# EAGLE design untitled (EAGLE 7.2.0)
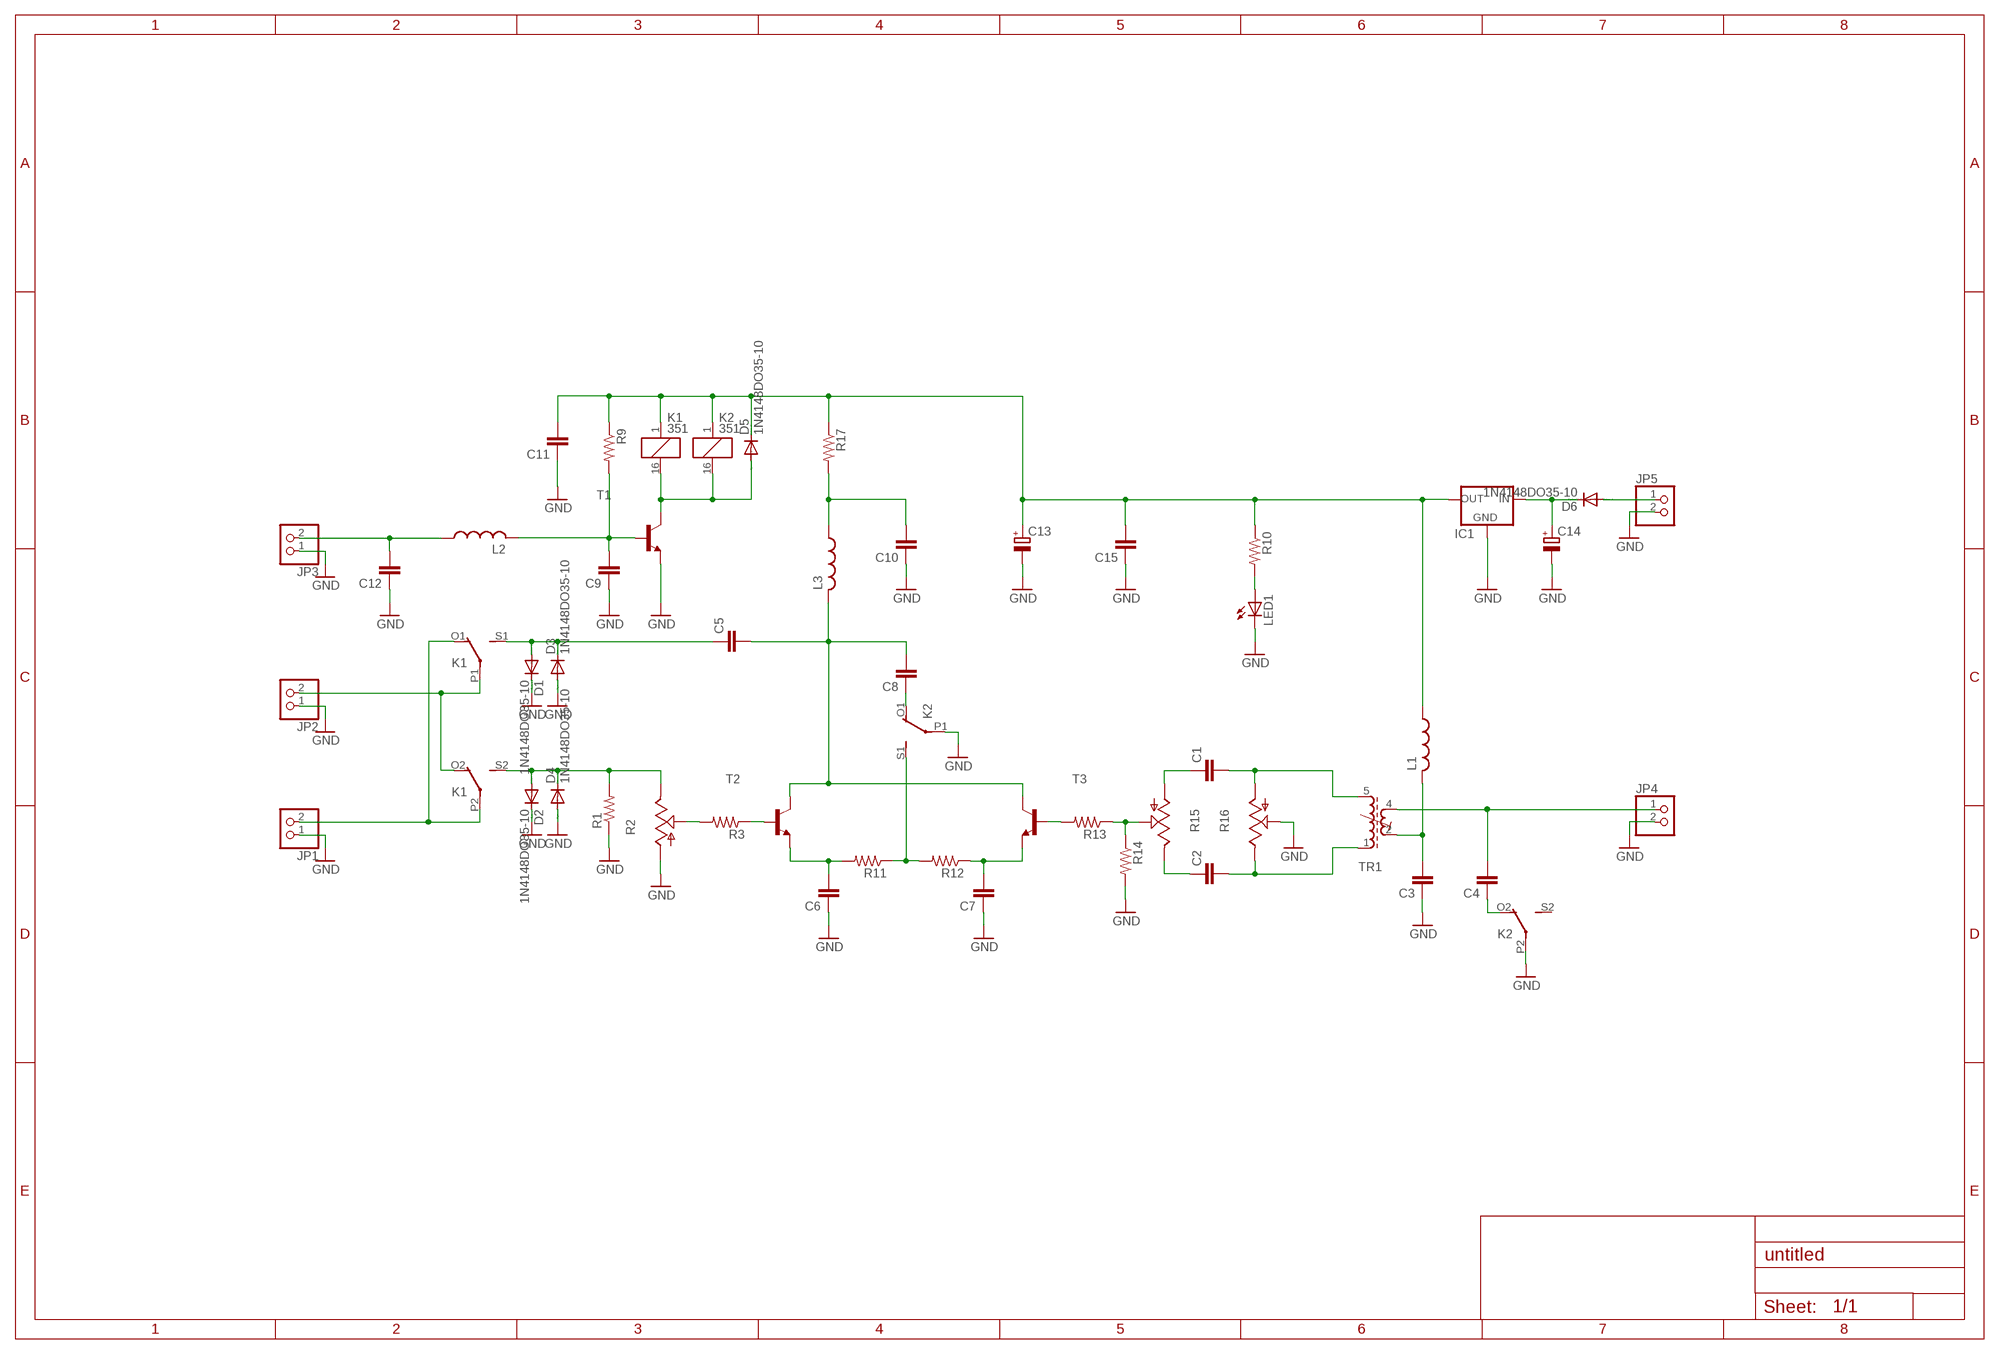
[diagram p0: schematic, sheet 1]

## Parts
C1  C-EU050-025X075  [C050-025X075]
C2  C-EU050-025X075  [C050-025X075]
C3  C-EU050-025X075  [C050-025X075]
C4  C-EU050-025X075  [C050-025X075]
C5  C-EU050-025X075  [C050-025X075]
C6  C-EU050-025X075  [C050-025X075]
C7  C-EU050-025X075  [C050-025X075]
C8  C-EU050-025X075  [C050-025X075]
C9  C-EU050-025X075  [C050-025X075]
C10  C-EU050-025X075  [C050-025X075]
C11  C-EU050-025X075  [C050-025X075]
C12  C-EU050-025X075  [C050-025X075]
C13  CPOL-EUE2.5-5  [E2,5-5]
C14  CPOL-EUE2.5-5  [E2,5-5]
C15  C-EU050-025X075  [C050-025X075]
D1  1N4148DO35-10  [DO35-10]
D2  1N4148DO35-10  [DO35-10]
D3  1N4148DO35-10  [DO35-10]
D4  1N4148DO35-10  [DO35-10]
D5  1N4148DO35-10  [DO35-10]
D6  1N4148DO35-10  [DO35-10]
IC1  78XXS  [78XXS]
JP1  PINHD-1X2  [1X02]
JP2  PINHD-1X2  [1X02]
JP3  PINHD-1X2  [1X02]
JP4  PINHD-1X2  [1X02]
JP5  PINHD-1X2  [1X02]
K1  351  [351]
K2  351  [351]
L1  L-US0207/7  [0207/7]
L2  L-US0207/7  [0207/7]
L3  L-US0207/7  [0207/7]
LED1  LED3MM  [LED3MM]
R1  R-US_0309/12  [0309/12]
R2  TRIM_US-CIP20C-6MM  [CIP20C-6MM]
R3  R-US_0207/7  [0207/7]
R9  R-US_0207/7  [0207/7]
R10  R-US_0207/7  [0207/7]
R11  R-US_0207/7  [0207/7]
R12  R-US_0207/7  [0207/7]
R13  R-US_0207/7  [0207/7]
R14  R-US_0207/7  [0207/7]
R15  TRIM_US-CIP20C-6MM  [CIP20C-6MM]
R16  TRIM_US-CIP20C-6MM  [CIP20C-6MM]
R17  R-US_0207/7  [0207/7]
T1  -NPN-TO92-EBC  [TO92-EBC]
T2  -NPN-TO92-EBC  [TO92-EBC]
T3  -NPN-TO92-EBC  [TO92-EBC]
TR1  71-4-1524  [71-5]

## Nets
GND: C3.1 C6.1 C7.1 C9.1 C10.1 C11.1 C12.1 C13.- C14.- C15.1 D1.C D2.C D3.A D4.A IC1.GND JP1.1 JP2.1 JP3.1 JP4.2 JP5.2 K2.P1(2:P) K2.P2(3:P) LED1.K(C) R1.1 R2.A R14.2 R16.S T1.E
N$1: JP2.2 K1.O2(3:O) K1.P1(2:P)
N$2: JP1.2 K1.O1(2:O) K1.P2(3:P)
N$3: C5.1 D1.A D3.C K1.S1(2:S)
N$4: D2.A D4.C K1.S2(3:S) R1.2 R2.E
N$5: R2.S R3.2
N$6: R3.1 T2.B
N$7: C6.2 R11.2 T2.E
N$8: K2.S1(2:S) R11.1 R12.2
N$9: C7.2 R12.1 T3.E
N$10: R13.1 R14.1 R15.S
N$11: R13.2 T3.B
N$12: C1.2 R16.A TR1.5(E1)
N$13: C2.2 R16.E TR1.1(A1)
N$14: C2.1 R15.E
N$15: C1.1 R15.A
N$16: C5.2 C8.2 L3.2 T2.C T3.C
N$17: LED1.A R10.2
N$18: C4.1 K2.O2(3:O)
N$19: C3.2 L1.2 TR1.2(A2)
N$20: C4.2 JP4.1 TR1.4(E2)
N$21: C12.2 JP3.2 L2.1
N$22: C8.1 K2.O1(2:O)
N$23: C9.2 L2.2 R9.2 T1.B
N$24: D5.A K1.16 K2.16 T1.C
N$25: C14.+ D6.C IC1.IN
N$26: C11.2 C13.+ C15.2 D5.C IC1.OUT K1.1 K2.1 L1.1 R9.1 R10.1 R17.1
N$27: C10.2 L3.1 R17.2
N$28: D6.A JP5.1
Unconnected: K2.S2(3:S) TR1.S1 TR1.S2

## Library data of the parts
C1-C12 C15 = rcl:C-EU: CAPACITOR, European symbol
C13 C14 = rcl:CPOL-EU: POLARIZED CAPACITOR, European symbol
D1-D6 = diode:1N4148: DIODE high speed (Philips)
IC1 = v-reg:78XXS: VOLTAGE REGULATOR
JP1-JP5 = pinhead:PINHD-1X2: PIN HEADER
K1 K2 = relay:351: RELAY 2 x switch, Omron; OC_FARNELL: unknown; OC_NEWARK: unknown
L1-L3 = rcl:L-US: INDUCTOR, American symbol
LED1 = led:LED: LED OSRAM: - CHIPLED LG R971, LG N971, LY N971, LG Q971, LY Q971, LO R971, LY R971 LH N974, LH R974 LS Q976, LO Q976, LY Q976 LO Q996 - Hyper CHIPLED LW Q18S LB Q993, LB Q99A, LB R99A - SideLED LS A670, LO A670, LY A670, LG A670, LP A670 LB A673, LV A673, LT A673, LW A673 LH A674 LY A675 LS A676, LA A676, LO A676, LY A676, LW A676 LS A679, LY A679, LG A679 - Hyper Micro SIDELED® LS Y876, LA Y876, LO Y876, LY Y876 LT Y87S - SmartLED LW L88C, LW L88S LB L89C, LB L89S, LG L890 LS L89K, LO L89K, LY L89K LS L896, LA L896, LO L896, LY L896 - TOPLED LS T670, LO T670, LY T670, LG T670, LP T670 LSG T670, LSP T670, LSY T670, LOP T670, LYG T670 LG T671, LOG T671, LSG T671 LB T673, LV T673, LT T673, LW T673 LH T674 LS T676, LA T676, LO T676, LY T676, LB T676, LH T676, LSB T676, LW T676 LB T67C, LV T67C, LT T67C, LS T67K, LO T67K, LY T67K, LW E67C LS E67B, LA E67B, LO E67B, LY E67B, LB E67C, LV E67C, LT E67C LW T67C LS T679, LY T679, LG T679 LS T770, LO T770, LY T770, LG T770, LP T770 LB T773, LV T773, LT T773, LW T773 LH T774 LS E675, LA E675, LY E675, LS T675 LS T776, LA T776, LO T776, LY T776, LB T776 LHGB T686 LT T68C, LB T68C - Hyper Mini TOPLED® LB M676 - Mini TOPLED Santana® LG M470 LS M47K, LO M47K, LY M47K Source: http://www.osram.convergy.de LUXEON: - LUMILED® LXK2-PW12-R00, LXK2-PW12-S00, LXK2-PW14-U00, LXK2-PW14-V00 LXK2-PM12-R00, LXK2-PM12-S00, LXK2-PM14-U00 LXK2-PE12-Q00, LXK2-PE12-R00, LXK2-PE12-S00, LXK2-PE14-T00, LXK2-PE14-U00 LXK2-PB12-K00, LXK2-PB12-L00, LXK2-PB12-M00, LXK2-PB14-N00, LXK2-PB14-P00, LXK2-PB14-Q00 LXK2-PR12-L00, LXK2-PR12-M00, LXK2-PR14-Q00, LXK2-PR14-R00 LXK2-PD12-Q00, LXK2-PD12-R00, LXK2-PD12-S00 LXK2-PH12-R00, LXK2-PH12-S00 LXK2-PL12-P00, LXK2-PL12-Q00, LXK2-PL12-R00 Source: www.luxeon.com KINGBRIGHT: KA-3528ASYC Source: www.kingbright.com
R1 R3 R9-R14 R17 = rcl:R-US_: RESISTOR, American symbol
R2 R15 R16 = pot:TRIM_US-: POTENTIOMETER
T1-T3 = transistor:*-NPN-: NPN Transistror BF959 corrected 2008.03.06
TR1 = inductor-neosid:71-4-: TRANSFORMER adjustable filter transformer; OC_FARNELL: unknown; OC_NEWARK: unknown

## Board
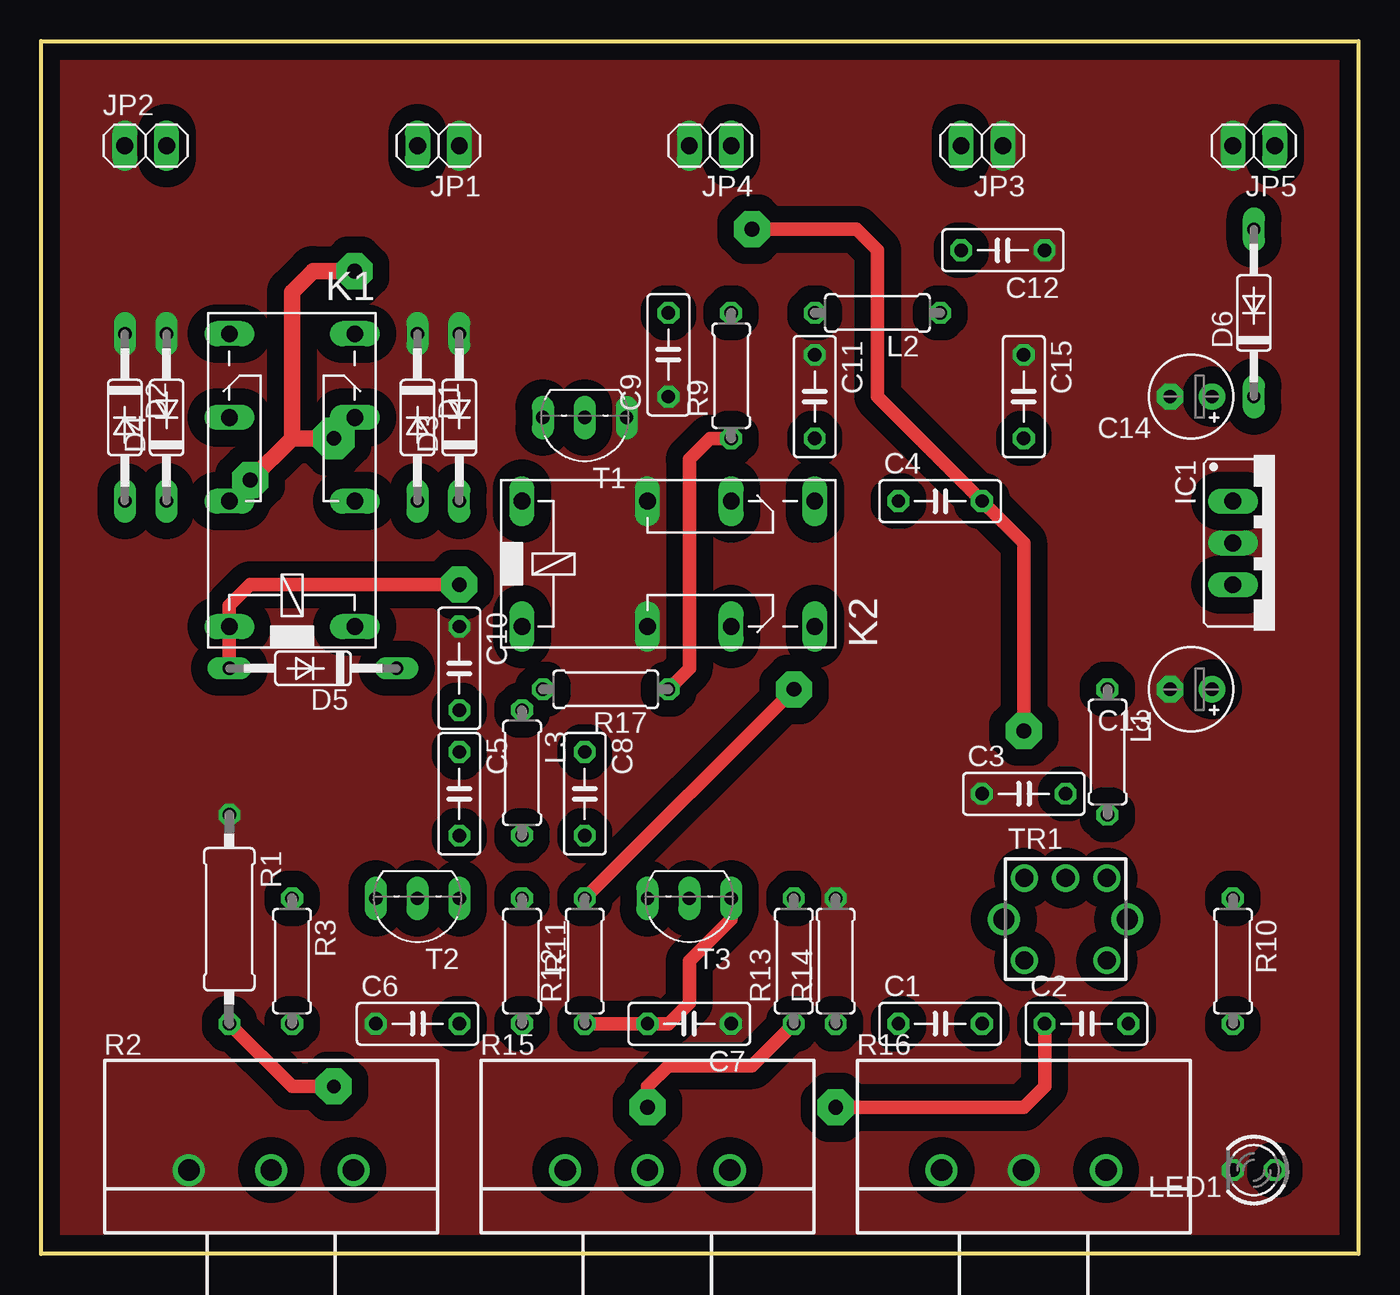
[diagram p1: board, top side]
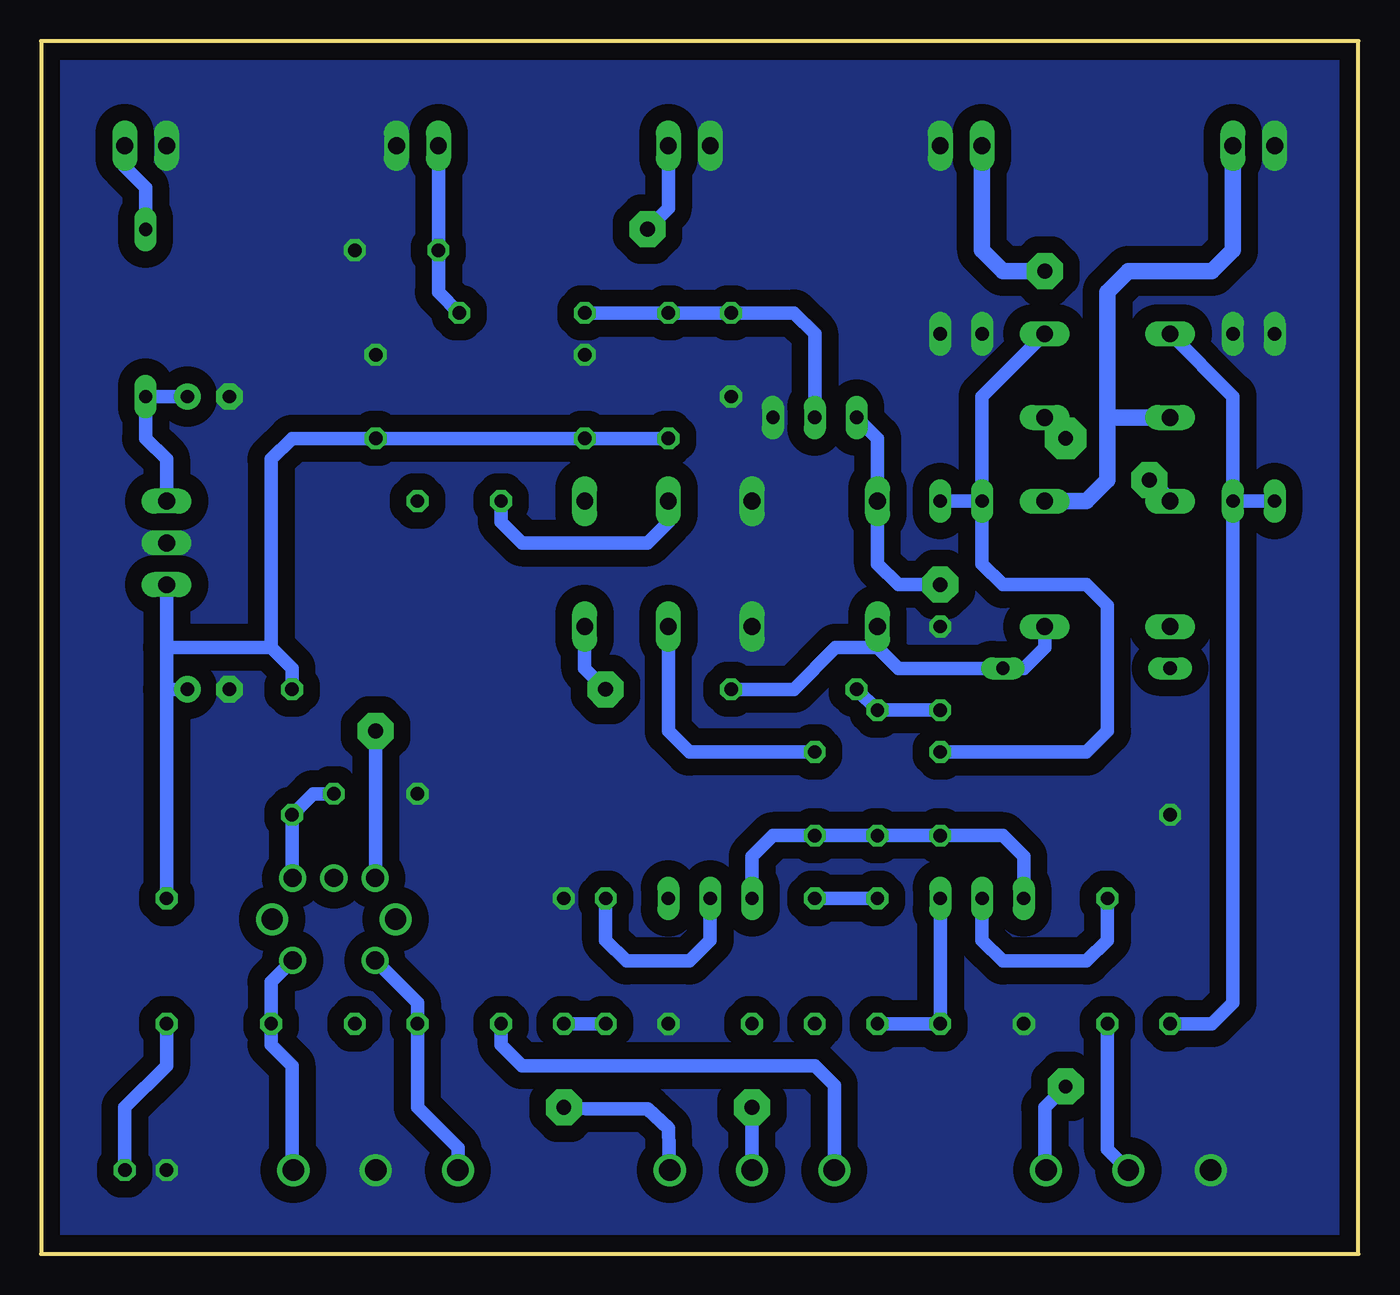
[diagram p2: board, bottom side, seen from below]

Size 80.01 x 73.66 mm. Coordinates in mm from the lower left corner, seen from the top.
Outline: 0,73.66 80.01,73.66 80.01,0 0,0 0,73.66
Copper layers (1*16): Top 0.035mm / dielectric 1.5mm / Bottom 0.035mm
Design rules "default": minimum track width 10mil, minimum drill 24mil, track to track 8mil, track to pad 8mil, pad to pad 8mil, via to via 8mil, smd to smd 8mil, copper to edge 40mil, drill to drill 8mil, minimum pad ring 10mil, minimum via ring 8mil, stop-mask expansion 4mil, vias tented up to drill 0mil, thermal gap 10mil

### Footprints (pad centres in the part's own frame; a part is rotated, then mirrored left to right if it is on the bottom)
C050-025X075 = drill 0.813 octagon: 1 -2.54,0; 2 2.54,0
E2,5-5 = drill 0.813 pad 1.6: + -1.27,0 | drill 0.813 pad 1.6 octagon: - 1.27,0
DO35-10 = drill 0.813 long: A 5.08,0; C -5.08,0
78XXS = drill 1.016 long: GND 0,-2.54; IN -2.54,-2.54; OUT 2.54,-2.54
1X02 = drill 1.016 long: 1 -1.27,0; 2 1.27,0
351 = drill 1.016 long: 1 -3.81,-3.81; 16 -3.81,3.81; O1 8.89,-3.81; O2 8.89,3.81; P1 3.81,-3.81; P2 3.81,3.81; S1 13.97,-3.81; S2 13.97,3.81
0207/7 = drill 0.813 octagon: 1 -3.81,0; 2 3.81,0
LED3MM = drill 0.813 octagon: A -1.27,0; K 1.27,0
0309/12 = drill 0.813 octagon: 1 -6.35,0; 2 6.35,0
CIP20C-6MM = drill 1.3 pad 1.93: A -5,0; E 5,0; S 0,0
TO92-EBC = drill 0.813 long: B 0,-1.27; C 2.54,-1.27; E -2.54,-1.27
71-5 = drill 1.1: 1 2.5,-2.5; 2 2.5,2.5; 3 0,2.5; 4 -2.5,2.5; 5 -2.5,-2.5 | drill 1.3: S1 -3.75,0; S2 3.75,0

### Placement (x,y rotation side)
C1  54.61,13.97 0 top
C2  63.5,13.97 0 top
C3  59.69,27.94 0 top
C4  54.61,45.72 0 top
C5  25.4,27.94 270 top
C6  22.86,13.97 0 top
C7  39.37,13.97 180 top
C8  33.02,27.94 270 top
C9  38.1,54.61 90 top
C10  25.4,35.56 270 top
C11  46.99,52.07 270 top
C12  58.42,60.96 180 top
C13  69.85,34.29 180 top
C14  69.85,52.07 180 top
C15  59.69,52.07 270 top
D1  22.86,50.8 270 top
D2  5.08,50.8 270 top
D3  25.4,50.8 90 top
D4  7.62,50.8 90 top
D5  16.51,35.56 180 top
D6  73.66,57.15 90 top
IC1  74.93,43.18 270 top
JP1  24.13,67.31 180 top
JP2  6.35,67.31 0 top
JP3  57.15,67.31 180 top
JP4  40.64,67.31 180 top
JP5  73.66,67.31 180 top
K1  15.24,41.91 90 top
K2  33.02,41.91 0 top
L1  64.77,30.48 270 top
L2  50.8,57.15 180 top
L3  29.21,29.21 270 top
LED1  73.66,5.08 180 top
R1  11.43,20.32 270 top
R2  13.97,5.08 0 top
R3  15.24,17.78 270 top
R9  41.91,53.34 90 top
R10  72.39,17.78 270 top
R11  29.21,17.78 270 top
R12  33.02,17.78 90 top
R13  45.72,17.78 90 top
R14  48.26,17.78 90 top
R15  36.83,5.08 0 top
R16  59.69,5.08 0 top
R17  34.29,34.29 180 top
T1  33.02,49.53 180 top
T2  22.86,20.32 180 top
T3  39.37,20.32 180 top
TR1  62.23,20.32 0 top

### Tracks (layer width: path | path; a pad name or v marks a point on that pad's centre or on a via)
GND
  pour Bottom (isolate 1.016, no thermals): 0,73.66 80.01,73.66 80.01,0 0,0
  pour Top (isolate 1.016, no thermals): 0,73.66 80.01,73.66 80.01,0 0,0
N$1
  Bottom 1.016: JP2.2 7.62,60.96 8.89,59.69 13.97,59.69 15.24,58.42 15.24,50.8 | 15.24,50.8 K1.O2 | K1.P1 16.51,45.72 15.24,46.99 15.24,50.8
N$2  (via drill 0.6, 0.9 pad 2.18, 0.9 pad 2.54)
  Top 1.016: 15.24,49.53 15.24,58.42 16.51,59.69 v19.05,59.69 | v17.78,49.53 15.24,49.53 | v12.7,46.99 15.24,49.53
  Bottom 1.016: v19.05,59.69 21.59,59.69 22.86,60.96 JP1.2 | K1.O1 v17.78,49.53 | K1.P2 v12.7,46.99
N$3
  Bottom 0.813: K1.S1 22.86,52.07 D1.A | D1.A D3.C | C5.1 16.51,30.48 15.24,31.75 15.24,39.37 16.51,40.64 21.59,40.64 22.86,41.91 D1.A
N$4  (via drill 0.8 pad 2.18)
  Top 0.813: R1.2 15.24,10.16 v17.78,10.16
  Bottom 0.813: K1.S2 7.62,52.07 D4.C | D2.A D4.C | D4.C 7.62,15.24 8.89,13.97 R1.2 | v17.78,10.16 19.05,8.89 19.05,5.16 R2.E
N$5
  Bottom 0.813: R2.S 15.24,6.35 R3.2
N$6
  Bottom 0.813: R3.1 15.24,19.05 16.51,17.78 21.59,17.78 22.86,19.05 T2.B
N$7
  Bottom 0.813: T2.E C6.2 R11.2
N$8  (via drill 0.9 pad 2.18)
  Top 0.813: R12.2 v45.72,34.29
  Bottom 0.813: R11.1 R12.2 | v45.72,34.29 46.99,35.56 K2.S1
N$9
  Top 0.813: R12.1 C7.2 38.1,13.97 39.37,15.24 39.37,17.78 41.91,20.32 T3.E
N$10  (via drill 0.9 pad 2.18)
  Top 0.813: v36.83,8.89 36.83,10.16 38.1,11.43 43.18,11.43 R13.1
  Bottom 0.813: R14.1 R13.1 | R15.S v36.83,8.89
N$11
  Bottom 0.813: T3.B 39.37,19.05 40.64,17.78 44.45,17.78 45.72,19.05 R13.2
N$12
  Bottom 0.813: R16.A 54.69,6.43 57.15,8.89 C1.2 57.15,15.24 TR1.5
N$13
  Bottom 0.813: R16.E 64.77,5.08 64.77,11.43 66.04,12.7 C2.2 66.04,16.51 TR1.1
N$14  (via drill 0.9 pad 2.18)
  Top 0.813: v48.26,8.89 59.69,8.89 60.96,10.16 C2.1
  Bottom 0.813: R15.E 41.91,7.62 43.18,8.81 46.91,8.81 v48.26,8.89
N$15
  Bottom 0.813: R15.A 31.83,10.24 33.02,11.43 50.8,11.43 52.07,12.7 C1.1
N$16
  Bottom 0.813: T2.C 20.32,24.13 21.59,25.4 C5.2 L3.2 C8.2 35.56,25.4 36.83,24.13 T3.C
N$17
  Bottom 0.813: R10.2 72.39,11.43 74.93,8.89 LED1.A
N$18
  Bottom 0.813: C4.1 52.07,44.45 50.8,43.18 43.18,43.18 41.91,44.45 K2.O2
N$19
  Bottom 0.813: C3.2 63.5,27.94 L1.2 64.77,22.86 TR1.2
N$20  (via drill 0.9 pad 2.18)
  Top 0.813: v43.18,62.23 49.53,62.23 50.8,60.96 50.8,52.07 C4.2 59.69,43.18 v59.69,31.75
  Bottom 0.813: JP4.1 41.91,63.5 v43.18,62.23 | v59.69,31.75 59.69,22.86 TR1.4
N$21
  Bottom 0.813: JP3.2 C12.2 55.88,58.42 L2.1
N$22
  Bottom 0.813: C8.1 40.64,30.48 41.91,31.75 K2.O1
N$23
  Bottom 0.813: L2.2 R9.2 C9.2 34.29,57.15 33.02,55.88 T1.B
N$24  (via drill 0.9 pad 2.18)
  Top 0.813: D5.A K1.16 11.43,39.37 12.7,40.64 v25.4,40.64
  Bottom 0.813: v25.4,40.64 27.94,40.64 29.21,41.91 K2.16 29.21,49.53 T1.C
N$25
  Bottom 0.813: IC1.IN 72.39,48.26 73.66,49.53 D6.C C14.+
N$26
  Top 0.813: R9.1 40.64,49.53 39.37,48.26 39.37,35.56 R17.1
  Bottom 0.813: K1.1 19.05,36.83 20.32,35.56 D5.C 27.94,35.56 29.21,36.83 | 29.21,36.83 K2.1 | 29.21,36.83 31.75,36.83 34.29,34.29 R17.1 | R9.1 C11.2 C15.2 64.77,49.53 66.04,48.26 66.04,36.83 | IC1.OUT 72.39,36.83 | 72.39,36.83 72.39,34.29 | 72.39,34.29 R10.1 | C13.+ 72.39,34.29 | L1.1 64.77,35.56 66.04,36.83 | 66.04,36.83 72.39,36.83
N$27
  Bottom 0.813: C10.2 L3.1 R17.2
N$28
  Bottom 0.813: JP5.1 74.93,66.04 73.66,64.77 D6.A
(copper drawn outside any net)
  shapes: Top area x2